# EAGLE design comms_sys_schematic (EAGLE 9.5.2)
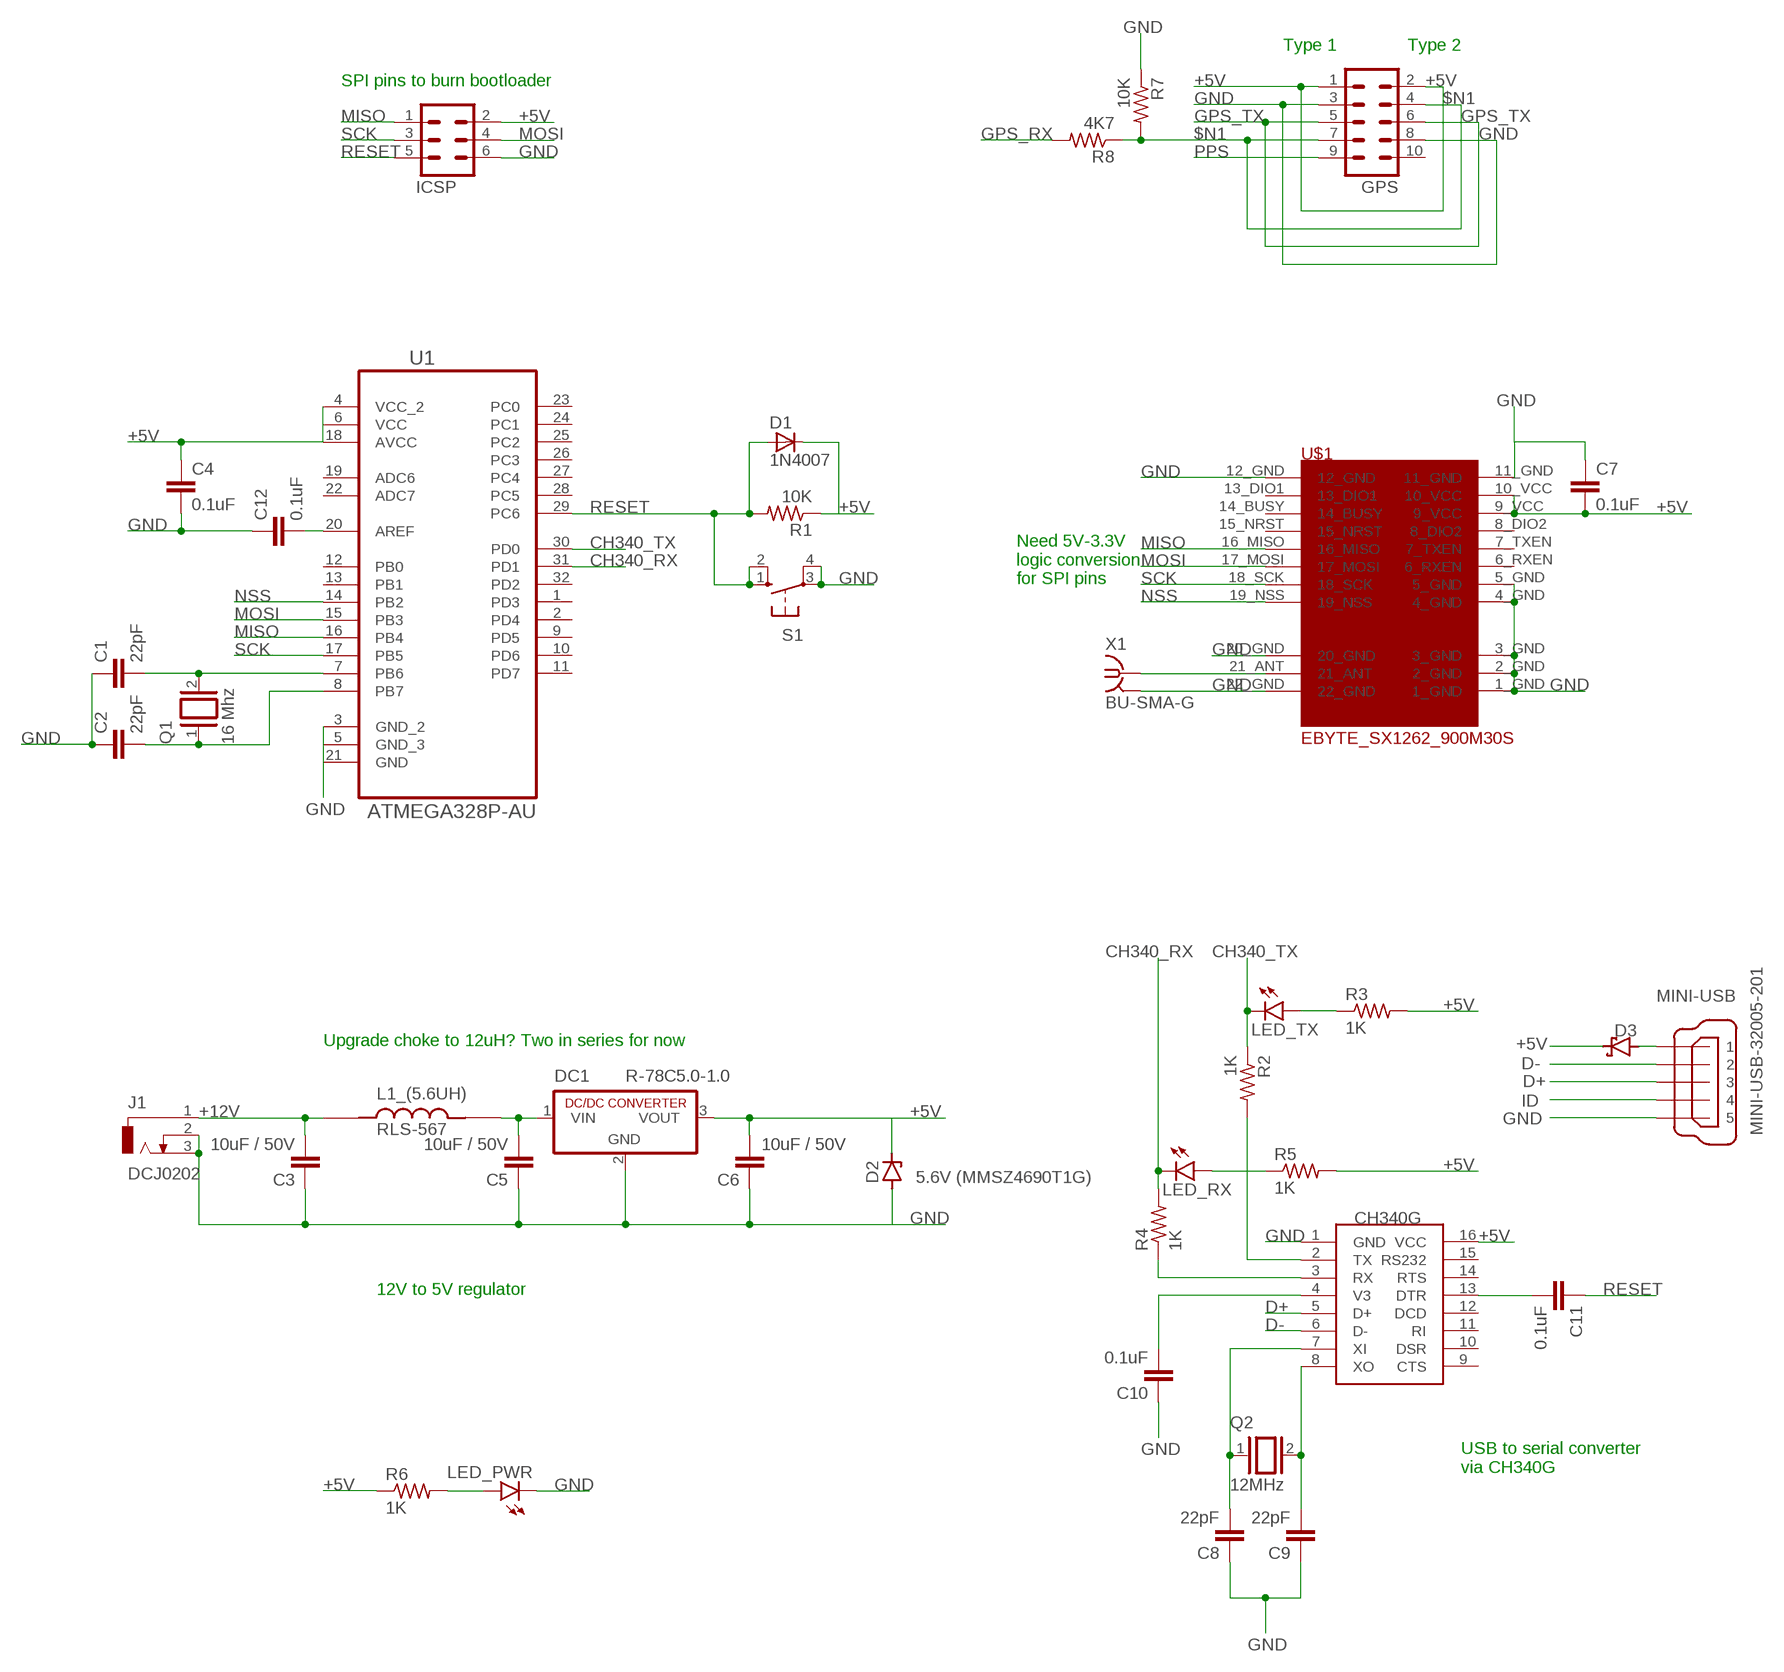
[diagram p0: schematic, sheet 1]

## Parts
C1  22pF  C2,5-3  [C2.5-3]
C2  22pF  C2,5-3  [C2.5-3]
C3  10uF / 50V  C2,5-3  [C2.5-3]
C4  0.1uF  C2,5-3  [C2.5-3]
C5  10uF / 50V  C2,5-3  [C2.5-3]
C6  10uF / 50V  C2,5-3  [C2.5-3]
C7  0.1uF  C2,5-3  [C2.5-3]
C8  22pF  C2,5-3  [C2.5-3]
C9  22pF  C2,5-3  [C2.5-3]
C10  0.1uF  C2,5-3  [C2.5-3]
C11  0.1uF  C2,5-3  [C2.5-3]
C12  0.1uF  C2,5-3  [C2.5-3]
D1  1N4007  [SMA]
D2  5.6V (MMSZ4690T1G)  ZENER-DIODEDO41Z10  [DO41Z10]
D3  SCHOTTKY-DIODESMD  [SMB]
DC1  R-78C5.0-1.0  [SIP3]
GPS  MA05-2  [MA05-2]
ICSP  MA03-2  [MA03-2]
J1  DCJ0202  [DCJ0202]
L1_(5.6UH)  RLS-567  [IND_RLS-567]
LED_PWR  LEDCHIP-LED0805  [CHIP-LED0805]
LED_RX  LEDCHIP-LED0805  [CHIP-LED0805]
LED_TX  LEDCHIP-LED0805  [CHIP-LED0805]
MINI-USB  MINI-USB-32005-201  [32005-201]
Q1  16 Mhz  XTAL/S  [QS]
Q2  12MHz  XTAL/S  [QS]
R1  10K  R-US_R0805  [R0805]
R2  1K  R-US_R0805  [R0805]
R3  1K  R-US_R0805  [R0805]
R4  1K  R-US_R0805  [R0805]
R5  1K  R-US_R0805  [R0805]
R6  1K  R-US_R0805  [R0805]
R7  10K  R-US_R0805  [R0805]
R8  4K7  R-US_R0805  [R0805]
S1  10-XX  [B3F-10XX]
U1  ATMEGA328P-AU  [QFP80P900X900X120-32N]
U$1  EBYTE_SX1262_900M30S  [EBYTE_SX1262_900M30S_FOOTPRINT]
U$2  CH340G  [SOIC16]
X1  BU-SMA-G  [BU-SMA-G]

## Nets
$N1: GPS.4 GPS.7 R7.2 R8.1
+5V: C4.1 C6.2 C7.2 D1.K(C) D2.C D3.C DC1.3(VOUT) GPS.1 GPS.2 ICSP.2 R1.1 R3.2 R5.2 R6.1 U1.4(VCC_2) U1.6(VCC) U1.18(AVCC) U$1.9_VCC U$1.10_VCC U$2.16(VCC)
+12V: C3.2 J1.1 L1_(5.6UH).1
CH340_RX: LED_RX.C R4.2 U1.31(PD1)
CH340_TX: LED_TX.C R2.1 U1.30(PD0)
D+: MINI-USB.3 U$2.5(D+)
D-: MINI-USB.2 U$2.6(D-)
GND: C1.1 C2.1 C3.1 C4.2 C5.1 C6.1 C7.1 C8.1 C9.1 C10.1 C12.1 D2.A DC1.2(GND) GPS.3 GPS.8 ICSP.6 J1.2 J1.3 LED_PWR.C MINI-USB.5 R7.1 S1.3(P) S1.4(P1) U1.3(GND_2) U1.5(GND_3) U1.21(GND) U$1.1_GND U$1.2_GND U$1.3_GND U$1.4_GND U$1.5_GND U$1.11_GND U$1.12_GND U$1.20_GND U$1.22_GND U$2.1(GND) X1.2 X1.3 X1.4 X1.5
GPS_RX: R8.2
GPS_TX: GPS.5 GPS.6
ID: MINI-USB.4
MISO: ICSP.1 U1.16(PB4) U$1.16_MISO
MOSI: ICSP.4 U1.15(PB3) U$1.17_MOSI
N$1: C1.2 Q1.2 U1.7(PB6)
N$2: C2.2 Q1.1 U1.8(PB7)
N$3: C8.2 Q2.1 U$2.7(XI)
N$4: LED_PWR.A R6.2
N$5: C9.2 Q2.2 U$2.8(XO)
N$6: C5.2 DC1.1(VIN) L1_(5.6UH).2
N$7: D3.A MINI-USB.1
N$8: U$1.21_ANT X1.1
N$9: C10.2 U$2.4(V3)
N$10: C11.2 U$2.13(DTR)
N$11: R2.2 U$2.2(TX)
N$12: LED_TX.A R3.1
N$13: R4.1 U$2.3(RX)
N$14: C12.2 U1.20(AREF)
N$16: LED_RX.A R5.1
NSS: U1.14(PB2) U$1.19_NSS
PPS: GPS.9
RESET: C11.1 D1.A ICSP.5 R1.2 S1.1(S) S1.2(S1) U1.29(PC6)
SCK [SCK]: ICSP.3 U1.17(PB5) U$1.18_SCK
Unconnected: GPS.10 U1.1(PD3) U1.2(PD4) U1.9(PD5) U1.10(PD6) U1.11(PD7) U1.12(PB0) U1.13(PB1) U1.19(ADC6) U1.22(ADC7) U1.23(PC0) U1.24(PC1) U1.25(PC2) U1.26(PC3) U1.27(PC4) U1.28(PC5) U1.32(PD2) U$1.6_RXEN U$1.7_TXEN U$1.8_DIO2 U$1.13_DIO1 U$1.14_BUSY U$1.15_NRST U$2.9(CTS) U$2.10(DSR) U$2.11(RI) U$2.12(DCD) U$2.14(RTS) U$2.15(RS232)

## Notes on the sheet
- Type 1 | Type 2
- SPI pins to burn bootloader
- Need 5V-3.3V
  logic conversion
  for SPI pins
- Upgrade choke to 12uH? Two in series for now
- 12V to 5V regulator
- USB to serial converter
  via CH340G

## Library data of the parts
C1-C12 = capacitor-wima:C: CAPACITOR naming: grid - package width
D1 = casovac:1N4007
D2 = diode:ZENER-DIODE: Z-Diode
D3 = diode:SCHOTTKY-DIODE: Schottky Diode
DC1 = dc-dc-converter:R-78C*-1.0: INNOLINE DC/DC-Converter 1.0 AMP SIP3 Single Output Source: Data sheet <http://www.mikrocontroller.net/attachment/150645/157764-da-01-en-DC_DC_WANDLER_R_78C5_0_1_0.pdf>
GPS = con-lstb:MA05-2: PIN HEADER; OC_FARNELL: unknown; OC_NEWARK: unknown
ICSP = con-lstb:MA03-2: PIN HEADER; OC_FARNELL: unknown; OC_NEWARK: unknown
J1 = con-jack:DCJ0202: DC POWER JACK Source: DCJ0202.pdf; OC_FARNELL: unknown; OC_NEWARK: unknown
L1_(5.6UH) = RLS-567:RLS-567: Line Inductors for RECOM Power Supply; AVAILABILITY: Unavailable; DESCRIPTION: Line Inductors for RECOM Power Supply; DIGIKEY-PURCHASE-URL: https://snapeda.com/shop?store=DigiKey&id=3641543; MF: Recom Power; MP: RLS-567; PACKAGE: 1812 Recom Power; PRICE: None
LED_PWR LED_RX LED_TX = led:LED: LED OSRAM: - CHIPLED LG R971, LG N971, LY N971, LG Q971, LY Q971, LO R971, LY R971 LH N974, LH R974 LS Q976, LO Q976, LY Q976 LO Q996 - Hyper CHIPLED LW Q18S LB Q993, LB Q99A, LB R99A - SideLED LS A670, LO A670, LY A670, LG A670, LP A670 LB A673, LV A673, LT A673, LW A673 LH A674 LY A675 LS A676, LA A676, LO A676, LY A676, LW A676 LS A679, LY A679, LG A679 - Hyper Micro SIDELED® LS Y876, LA Y876, LO Y876, LY Y876 LT Y87S - SmartLED LW L88C, LW L88S LB L89C, LB L89S, LG L890 LS L89K, LO L89K, LY L89K LS L896, LA L896, LO L896, LY L896 - TOPLED LS T670, LO T670, LY T670, LG T670, LP T670 LSG T670, LSP T670, LSY T670, LOP T670, LYG T670 LG T671, LOG T671, LSG T671 LB T673, LV T673, LT T673, LW T673 LH T674 LS T676, LA T676, LO T676, LY T676, LB T676, LH T676, LSB T676, LW T676 LB T67C, LV T67C, LT T67C, LS T67K, LO T67K, LY T67K, LW E67C LS E67B, LA E67B, LO E67B, LY E67B, LB E67C, LV E67C, LT E67C LW T67C LS T679, LY T679, LG T679 LS T770, LO T770, LY T770, LG T770, LP T770 LB T773, LV T773, LT T773, LW T773 LH T774 LS E675, LA E675, LY E675, LS T675 LS T776, LA T776, LO T776, LY T776, LB T776 LHGB T686 LT T68C, LB T68C - Hyper Mini TOPLED® LB M676 - Mini TOPLED Santana® LG M470 LS M47K, LO M47K, LY M47K Source: http://www.osram.convergy.de LUXEON: - LUMILED® LXK2-PW12-R00, LXK2-PW12-S00, LXK2-PW14-U00, LXK2-PW14-V00 LXK2-PM12-R00, LXK2-PM12-S00, LXK2-PM14-U00 LXK2-PE12-Q00, LXK2-PE12-R00, LXK2-PE12-S00, LXK2-PE14-T00, LXK2-PE14-U00 LXK2-PB12-K00, LXK2-PB12-L00, LXK2-PB12-M00, LXK2-PB14-N00, LXK2-PB14-P00, LXK2-PB14-Q00 LXK2-PR12-L00, LXK2-PR12-M00, LXK2-PR14-Q00, LXK2-PR14-R00 LXK2-PD12-Q00, LXK2-PD12-R00, LXK2-PD12-S00 LXK2-PH12-R00, LXK2-PH12-S00 LXK2-PL12-P00, LXK2-PL12-Q00, LXK2-PL12-R00 Source: www.luxeon.com KINGBRIGHT: KA-3528ASYC Source: www.kingbright.com
MINI-USB = con-cypressindustries:MINI-USB-: MINI USB-B Conector Source: www.cypressindustries.com; OC_FARNELL: unknown; OC_NEWARK: unknown
Q1 Q2 = special:XTAL/S: CRYSTAL
R1-R8 = rcl:R-US_: RESISTOR, American symbol; SPICEPREFIX: R
S1 = switch-omron:10-XX: OMRON SWITCH; MPN: B3F-1000; OC_FARNELL: 176432; OC_NEWARK: 36M3542
U1 = Atmel_By_element14_Batch_1-00:ATMEGA328P-AU: 8-bit Microcontroller with In-System Programmable Flash; MPN: ATMEGA328P-AU; OC_FARNELL: 1715486; OC_NEWARK: 14R4631; PACKAGE: TQFP-32; SUPPLIER: Atmel
U$1 = cust_parts:EBYTE_SX1262_900M30S
U$2 = ch340g:CH340G
X1 = con-coax:BU-SMA-G: FEMALE SMA CONNECTOR Radiall distributor RS 193-9117; OC_FARNELL: unknown; OC_NEWARK: unknown

## Board
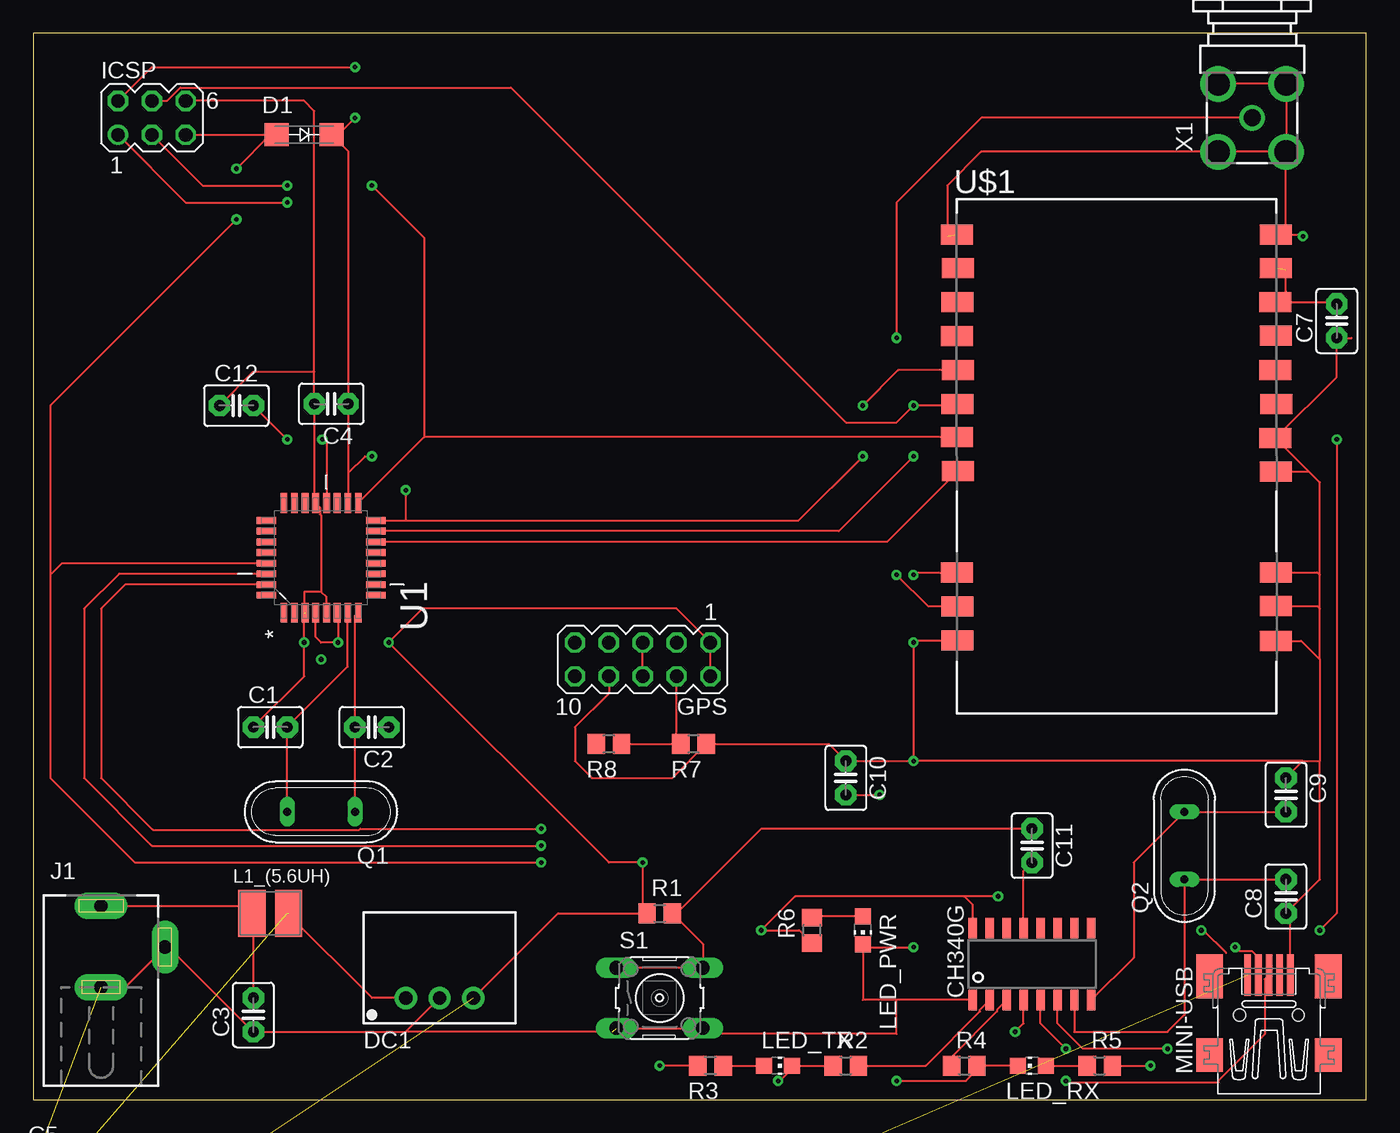
[diagram p1: board, top side]
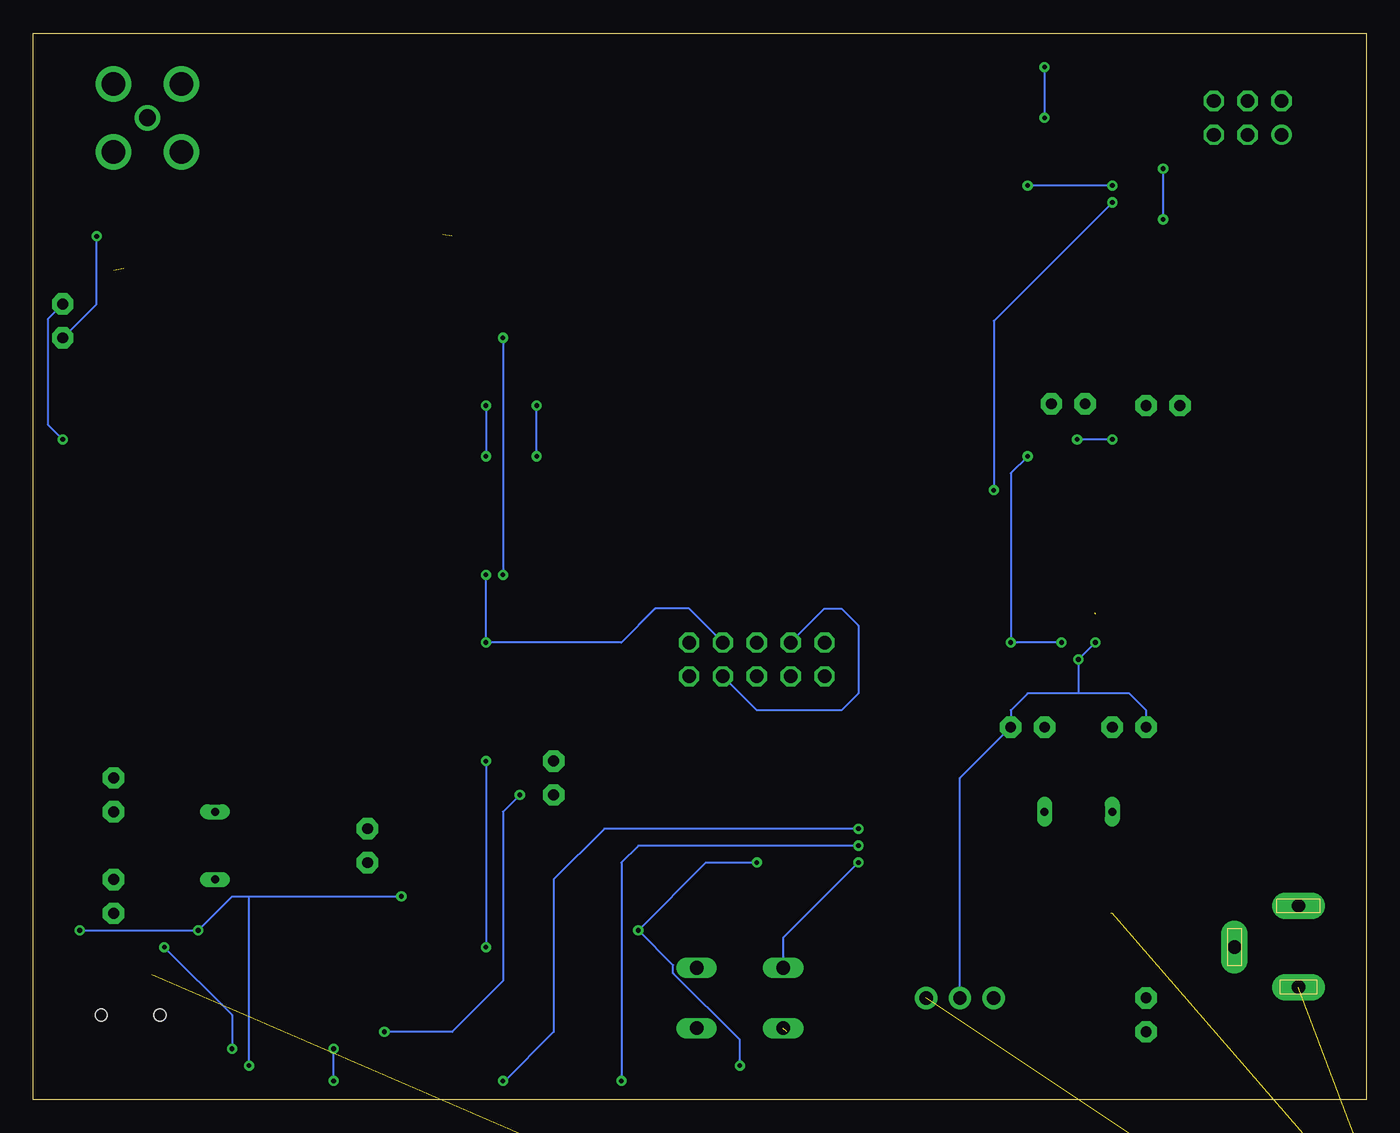
[diagram p2: board, bottom side, seen from below]

Size 100 x 80 mm. Coordinates in mm from the lower left corner, seen from the top.
Outline: 0,0 100,0 100,80 0,80 0,0
Copper layers (1*16): Top 0.035mm / dielectric 1.5mm / Bottom 0.035mm
Design rules "default": minimum track width 6mil, minimum drill 0.35mm, track to track 6mil, track to pad 6mil, pad to pad 6mil, via to via 6mil, smd to smd 6mil, copper to edge 40mil, drill to drill 6mil, minimum pad ring 10mil, minimum via ring 8mil, stop-mask expansion 4mil, vias tented up to drill 0mil, thermal gap 10mil

### Footprints (pad centres in the part's own frame; a part is rotated, then mirrored left to right if it is on the bottom)
C2.5-3 = drill 0.813 pad 1.6 octagon: 1 -1.27,0; 2 1.27,0
SMA = smd 1.8 x 1.7: A -2.05,0; K 2.05,0
DO41Z10 = drill 1.118: A 5.08,0; C -5.08,0
SMB = smd 2.4 x 2.4: A 2.2,0; C -2.2,0
SIP3 = drill 1 pad 1.676: 1 -2.54,0; 2 0,0; 3 2.54,0
MA05-2 = drill 1.016 octagon: 1 -5.08,-1.27; 2 -5.08,1.27; 3 -2.54,-1.27; 4 -2.54,1.27; 5 0,-1.27; 6 0,1.27; 7 2.54,-1.27; 8 2.54,1.27; 9 5.08,-1.27; 10 5.08,1.27
MA03-2 = drill 1.016: 1 -2.54,-1.27 | drill 1.016 octagon: 2 -2.54,1.27; 3 0,-1.27; 4 0,1.27; 5 2.54,-1.27; 6 2.54,1.27
DCJ0202 = drill 1 pad 2 long: 1 0,3.1; 2 4.8,0; 3 0,-3
IND_RLS-567 = smd 2.05 x 3.5: 1 -1.375,0; 2 1.375,0
CHIP-LED0805 = smd 1.2 x 1.2: A 0,-1.05; C 0,1.05
32005-201 = smd 3.1 x 0.5: 1 3,1.6; 2 3,0.8; 3 3,0; 4 3,-0.8; 5 3,-1.6 | smd 2.5 x 2: M1 -3,-4.45; M2 -3,4.45 | smd 3.3 x 2: M3 2.9,4.45; M4 2.9,-4.45 | hole 0.9: 0,2.2; 0,-2.2
QS = drill 0.61 long: 1 -2.54,0; 2 2.54,0
R0805 = smd 1.3 x 1.5: 1 -0.95,0; 2 0.95,0
B3F-10XX = drill 1.016 long: 1 -3.251,2.261; 2 3.251,2.261; 3 -3.251,-2.261; 4 3.251,-2.261
QFP80P900X900X120-32N = smd 1.473 x 0.508: 1 -4.115,2.794; 2 -4.115,2.007; 3 -4.115,1.194; 4 -4.115,0.406; 5 -4.115,-0.406; 6 -4.115,-1.194; 7 -4.115,-2.007; 8 -4.115,-2.794; 17 4.115,-2.794; 18 4.115,-2.007; 19 4.115,-1.194; 20 4.115,-0.406; 21 4.115,0.406; 22 4.115,1.194; 23 4.115,2.007; 24 4.115,2.794 | smd 0.508 x 1.473: 9 -2.794,-4.115; 10 -2.007,-4.115; 11 -1.194,-4.115; 12 -0.406,-4.115; 13 0.406,-4.115; 14 1.194,-4.115; 15 2.007,-4.115; 16 2.794,-4.115; 25 2.794,4.115; 26 2.007,4.115; 27 1.194,4.115; 28 0.406,4.115; 29 -0.406,4.115; 30 -1.194,4.115; 31 -2.007,4.115; 32 -2.794,4.115
EBYTE_SX1262_900M30S_FOOTPRINT = smd 2.4 x 1.5: 1_GND 11.946,-13.848; 2_GND 11.953,-11.232; 3_GND 11.946,-8.7; 4_GND 11.946,-1.155; 5_GND 11.915,1.361; 6_RXEN 11.984,3.939; 7_TXEN 11.907,6.479; 8_DIO2 11.953,9.049; 9_VCC 11.915,11.589; 10_VCC 11.938,14.113; 11_GND 11.946,16.622; 12_GND -11.991,16.645; 13_DIO1 -11.917,14.112; 14_BUSY -11.965,11.563; 15_NRST -11.986,9.038; 16_MISO -11.914,6.456; 17_MOSI -11.937,3.938; 18_SCK -11.986,1.435; 19_NSS -11.907,-1.1; 20_GND -11.992,-8.731; 21_ANT -11.93,-11.263; 22_GND -11.961,-13.818
SOIC16 = smd 0.635 x 1.524: 1 -4.445,-2.695; 2 -3.175,-2.695; 3 -1.905,-2.695; 4 -0.635,-2.695; 5 0.635,-2.695; 6 1.905,-2.695; 7 3.175,-2.695; 8 4.445,-2.695; 9 4.445,2.695; 10 3.175,2.695; 11 1.905,2.695; 12 0.635,2.695; 13 -0.635,2.695; 14 -1.905,2.695; 15 -3.175,2.695; 16 -4.445,2.695
BU-SMA-G = drill 1.27: 1 0,0 | drill 1.778: 2 -2.55,2.55; 3 2.55,2.55; 4 2.55,-2.55; 5 -2.55,-2.55

### Placement (x,y rotation side)
C1  17.78,27.94 0 top
C2  25.4,27.94 180 top
C3  16.51,6.35 90 top
C4  22.35,52.2 180 top
C5  1.27,-5.08 0 top  (outside the outline)
C6  1.27,-12.7 0 top  (outside the outline)
C7  97.79,58.42 90 top
C8  93.98,15.24 90 top
C9  93.98,22.86 270 top
C10  60.96,24.13 270 top
C11  74.93,19.05 270 top
C12  15.24,52.07 0 top
D1  20.32,72.39 0 top
D2  5.08,-20.32 0 top  (outside the outline)
D3  2.54,-27.94 0 top  (outside the outline)
DC1  30.48,7.62 0 top
GPS  45.72,33.02 180 top
ICSP  8.89,73.66 0 top
J1  5.08,11.43 0 top
L1_(5.6UH)  17.78,13.97 0 top
LED_PWR  62.23,12.7 180 top
LED_RX  74.93,2.54 90 top
LED_TX  55.88,2.54 270 top
MINI-USB  92.71,6.35 90 top
Q1  21.59,21.59 180 top
Q2  86.36,19.05 90 top
R1  46.99,13.97 0 top
R2  60.96,2.54 0 top
R3  50.8,2.54 180 top
R4  69.85,2.54 0 top
R5  80.01,2.54 0 top
R6  58.42,12.7 90 top
R7  49.53,26.67 180 top
R8  43.18,26.67 180 top
S1  46.99,7.62 0 top
U1  21.59,40.64 90 top
U$1  81.28,48.26 0 top
U$2  74.93,10.16 0 top
X1  91.44,73.66 90 top

### Tracks (layer width: path | path; a pad name or v marks a point on that pad's centre or on a via)
$N1
  Top 0.152: R8.1 R7.2 48.26,26.99 GPS.4
  Bottom 0.152: GPS.7 40.64,36.83 39.37,36.83 38.1,35.56 38.1,30.48 39.37,29.21 45.72,29.21 GPS.4
+5V  (via drill 0.35)  (4 unrouted)
  Top 0.152: C7.2 97.63,59.85 U$1.9_VCC 93.98,60.63 93.98,62.23 | DC1.3 39.37,13.97 45.72,13.97 | 45.72,13.97 R1.1 | U$2.16 70.48,14.61 69.85,15.24 | v72.39,15.24 69.85,15.24 | 69.85,15.24 57.15,15.24 v54.61,12.7 57.47,12.7 R6.1 | 45.72,13.97 v45.72,17.78 43.18,17.78 v26.67,34.29 29.21,36.83 48.26,36.83 GPS.1 GPS.2 | U1.6 22.86,36.45 v22.86,34.29 21.59,34.29 21.18,34.7 U1.4 | 89.49,10.97 89.49,10.99 87.78,12.7 v87.63,12.7 | v96.52,12.7 97.79,13.97 v97.79,49.53 | R3.2 v46.99,2.54 | R5.2 v83.82,2.54 | D1.K 22.61,72.14 | 22.61,72.14 23.62,71.14 C4.1 23.62,46.99 | 23.62,46.99 23.62,44.78 U1.18 | ICSP.2 8.89,77.47 v24.13,77.47 | v24.13,73.66 22.61,72.14 | 23.62,46.99 24.89,48.26 v25.4,48.26
  Bottom 0.152: v45.72,17.78 49.53,17.78 v54.61,12.7 51.99,10.08 51.99,9.47 46.99,4.47 v46.99,2.54 | v22.86,34.29 v26.67,34.29 26.67,46.99 v25.4,48.26 | C7.2 98.91,58.57 98.91,50.65 v97.79,49.53 | 83.82,15.24 85.09,15.24 v87.63,12.7 v96.52,12.7 | 83.82,15.24 v72.39,15.24 | v83.82,2.54 83.82,15.24 | v24.13,77.47 v24.13,73.66
+12V
  Top 0.152: J1.1 15.85,14.53 L1_(5.6UH).1 16.51,13.87 C3.2
CH340_RX  (via drill 0.35)
  Top 0.152: LED_RX.C 71.12,2.54 | 71.12,2.54 R4.2 | U1.31 6.88,38.63 5.08,36.83 5.08,24.13 8.97,20.24 24.46,20.24 24.53,20.32 v38.1,20.32 | v64.77,1.39 69.97,1.39 71.12,2.54
  Bottom 0.152: v38.1,20.32 57.15,20.32 60.96,16.51 60.96,5.08 64.77,1.27 v64.77,1.39
CH340_TX  (via drill 0.35)
  Top 0.152: LED_TX.C 57.15,2.54 | 57.15,2.54 R2.1 | U1.30 6.43,39.45 3.81,36.83 3.81,24.13 8.89,19.05 v38.1,19.05 | v55.88,1.39 56,1.39 57.15,2.54
  Bottom 0.152: v38.1,19.05 54.61,19.05 55.88,17.78 v55.88,1.39 55.88,1.09
D+  (via drill 0.35)
  Top 0.152: MINI-USB.3 92.39,9.03 92.39,4.91 88.9,1.42 88.9,1.27 77.47,1.27 v77.47,1.39 | v77.47,3.81 75.56,5.71 U$2.5
  Bottom 0.152: v77.47,1.39 v77.47,3.81
D-  (via drill 0.35)
  Top 0.152: v90.17,11.43 90.47,11.13 91.45,11.13 91.91,10.67 MINI-USB.2 | v85.09,3.81 78.74,3.81 76.83,5.71 U$2.6
  Bottom 0.152: v90.17,11.43 85.09,6.35 v85.09,3.81
GND  (via drill 0.35)  (6 unrouted)
  Top 0.152: X1.3 X1.4 X1.5 | 68.58,64.77 68.58,68.58 71.11,71.11 X1.2 X1.5 | S1.3 49.53,5.36 | 49.53,5.36 S1.4 | v66.04,25.4 v66.04,34.29 66.19,34.44 U$1.22_GND | U$1.1_GND 95.13,34.41 96.52,33.02 | 96.52,33.02 96.52,25.4 | 95.25,25.4 v66.04,25.4 | X1.5 93.98,65.64 U$1.11_GND 95.14,64.88 v95.25,64.77 | J1.3 6.88,8.43 J1.2 10.16,11.43 C3.1 27.94,5.08 | 27.94,5.08 DC1.2 | 43.46,5.08 27.94,5.08 | 20.32,36.45 v20.32,34.29 20.32,31.75 C1.1 | C9.1 95.25,25.4 | 95.25,25.4 96.52,25.4 | 96.52,25.4 96.52,16.51 C8.1 94.31,13.64 MINI-USB.5 | 96.52,33.02 96.52,36.83 | 96.52,36.83 96.52,39.37 | 96.52,39.37 96.52,46.3 95.71,47.1 | 95.71,47.1 U$1.5_GND 97.79,54.22 C7.1 98.91,57.15 | U$1.4_GND 95.71,47.1 | U$1.2_GND 96.32,37.03 96.52,36.83 | U$1.3_GND 96.33,39.56 96.52,39.37 | X1.5 | v66.04,39.37 66.2,39.53 U$1.20_GND | U$2.1 64.77,7.46 | 64.77,7.46 62.23,7.46 LED_PWR.C 62.45,11.43 v66.04,11.43 | 49.53,5.36 49.96,4.92 64.77,4.92 64.77,7.46 | 21.08,54.61 C4.2 21.08,44.86 U1.21 21.51,44.42 21.51,43.92 21.59,43.85 21.59,38.1 | 21.08,54.61 21.08,74.17 20.32,74.93 ICSP.6 | v66.04,25.4 C10.1 59.69,26.67 R7.1 47.94,24.13 41.91,24.13 40.64,25.4 40.64,27.94 43.18,30.48 GPS.8 | C12.1 16.51,54.61 21.08,54.61 | U1.5 22,37.69 21.59,38.1 | 21.59,38.1 20.32,38.1 20.32,36.6 U1.3
  Bottom 0.152: v66.04,39.37 v66.04,34.29 55.88,34.29 53.34,36.83 50.8,36.83 GPS.3 | C1.1 16.51,29.21 17.78,30.48 21.59,30.48 | 21.59,30.48 25.4,30.48 26.67,29.21 C2.1 30.48,24.13 DC1.2 | 21.59,30.48 v21.59,33.02 v20.32,34.29 | C7.1 95.25,59.69 v95.25,64.77 | v66.04,25.4 v66.04,11.43
GPS_TX
  Top 0.152: GPS.6 GPS.5
MISO  (via drill 0.35)
  Top 0.152: U1.16 27.94,43.43 | 27.94,43.43 57.4,43.43 v62.23,48.26 | U$1.16_MISO 64.88,54.72 v62.23,52.07 | ICSP.1 11.43,67.31 v19.05,67.31 | v27.94,45.72 27.94,43.43
  Bottom 0.152: v62.23,48.26 v62.23,52.07 | v19.05,67.31 27.94,58.42 v27.94,45.72
MOSI  (via drill 0.35)
  Top 0.152: U1.15 60.43,42.65 v66.04,48.26 | U$1.17_MOSI 69.22,52.07 v66.04,52.07 64.77,50.8 60.96,50.8 35.84,75.92 11.02,75.92 10.03,74.93 ICSP.4
  Bottom 0.152: v66.04,52.07 v66.04,48.26
N$1
  Top 0.152: Q1.2 C1.2 23.6,32.49 U1.7
N$2
  Top 0.152: Q1.1 C2.2 24.13,36.27 U1.8
N$3
  Top 0.152: C8.2 Q2.1 86.36,6.35 85.09,5.08 78.11,5.08 U$2.7
N$4
  Top 0.152: LED_PWR.A 58.52,13.75 R6.2
N$5
  Top 0.152: C9.2 Q2.2 82.55,17.78 82.55,10.64 U$2.8
N$6  (2 unrouted)
  Top 0.152: DC1.1 25.4,7.62 19.05,13.97
N$7  (1 unrouted)
N$8  (via drill 0.35)
  Top 0.152: X1.1 71.12,73.66 64.77,67.31 v64.77,57.15 | U$1.21_ANT 67.14,37 v64.77,39.37
  Bottom 0.152: v64.77,57.15 v64.77,39.37
N$9  (via drill 0.35)
  Top 0.152: C10.2 v63.5,22.86 | v73.66,5.08 74.3,5.71 U$2.4
  Bottom 0.152: v63.5,22.86 64.77,21.59 64.77,8.89 68.58,5.08 v73.66,5.08
N$10
  Top 0.152: U$2.13 74.3,17.14 C11.2
N$11
  Top 0.152: U$2.2 71.03,6.74 71.03,6.61 66.96,2.54 R2.2
N$12
  Top 0.152: R3.1 LED_TX.A
N$13
  Top 0.152: U$2.3 72.3,6.74 72.3,6.61 68.9,3.21 R4.1
N$14  (via drill 0.35)
  Top 0.152: C12.2 v19.05,49.53 | v21.69,49.53 22,49.22 U1.20
  Bottom 0.152: v19.05,49.53 v21.69,49.53
N$16
  Top 0.152: LED_RX.A R5.1
NSS
  Top 0.152: U$1.19_NSS 64.05,41.83 U1.14
RESET  (via drill 0.35)
  Top 0.152: S1.1 S1.2 50.24,11.67 48.1,13.81 | R1.2 48.1,13.81 | U1.29 2.13,40.23 1.27,39.37 | 1.27,39.37 1.27,24.13 7.62,17.78 v38.1,17.78 | C11.1 54.61,20.32 48.1,13.81 | ICSP.5 D1.A 17.78,72.39 v15.24,69.85 | v15.24,66.04 1.27,52.07 1.27,39.37
  Bottom 0.152: v38.1,17.78 43.74,12.14 S1.1 | v15.24,69.85 v15.24,66.04
SCK  (via drill 0.35)
  Top 0.152: U$1.18_SCK 29.32,49.7 | 29.32,49.7 U1.17 | ICSP.3 12.7,68.58 v19.05,68.58 | v25.4,68.58 29.32,64.66 29.32,49.7
  Bottom 0.152: v19.05,68.58 v25.4,68.58